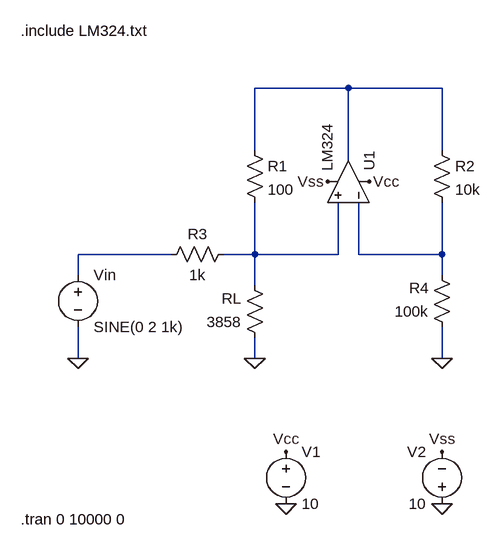
[diagram p0: schematic Circuito_2.asc]
Circuito_2.asc, the LTspice schematic file:
Version 4
SHEET 1 880 680
WIRE 128 0 -16 0
WIRE 272 0 128 0
WIRE -16 96 -16 0
WIRE 272 96 272 0
WIRE 128 112 128 0
WIRE -144 256 -288 256
WIRE -16 256 -16 176
WIRE -16 256 -64 256
WIRE 112 256 112 176
WIRE 112 256 -16 256
WIRE 144 256 144 176
WIRE 272 256 272 176
WIRE 272 256 144 256
WIRE -288 288 -288 256
WIRE 272 288 272 256
WIRE -16 304 -16 256
WIRE -288 416 -288 368
WIRE -16 416 -16 384
WIRE 272 416 272 368
FLAG -16 416 0
FLAG 272 416 0
FLAG 32 640 0
FLAG 272 640 0
FLAG 32 560 Vcc
FLAG 272 560 Vss
FLAG -288 416 0
FLAG 160 144 Vcc
FLAG 96 144 Vss
DATAFLAG 64 304 "-I(Rl)"
DATAFLAG 128 0 ""
DATAFLAG -16 48 "I(R1)"
DATAFLAG -224 240 "I(R3)"
DATAFLAG 368 32 "I(R2)"
DATAFLAG 368 384 "I(R4)"
DATAFLAG 128 0 ""
DATAFLAG 128 0 ""
DATAFLAG 128 0 ""
SYMBOL OpAmps\\opamp2 192 144 M270
SYMATTR InstName U1
SYMATTR Value LM324
SYMBOL res -32 80 R0
SYMATTR InstName R1
SYMATTR Value 100
SYMBOL res 256 80 R0
SYMATTR InstName R2
SYMATTR Value 10k
SYMBOL res -48 240 R90
WINDOW 0 0 56 VBottom 2
WINDOW 3 32 56 VTop 2
SYMATTR InstName R3
SYMATTR Value 1k
SYMBOL res 288 384 R180
WINDOW 0 36 76 Left 2
WINDOW 3 36 40 Left 2
SYMATTR InstName R4
SYMATTR Value 100k
SYMBOL res 0 400 R180
WINDOW 0 36 76 Left 2
WINDOW 3 36 40 Left 2
SYMATTR InstName RL
SYMATTR Value 3858
SYMBOL voltage 32 544 R0
WINDOW 123 0 0 Left 0
WINDOW 39 0 0 Left 0
SYMATTR InstName V1
SYMATTR Value 10
SYMBOL voltage 272 656 R180
WINDOW 0 24 96 Left 2
WINDOW 3 24 16 Left 2
WINDOW 123 0 0 Left 0
WINDOW 39 0 0 Left 0
SYMATTR InstName V2
SYMATTR Value 10
SYMBOL voltage -288 272 R0
WINDOW 123 0 0 Left 0
WINDOW 39 0 0 Left 0
SYMATTR InstName Vin
SYMATTR Value SINE(0 2 1k)
TEXT -376 -88 Left 2 !.include LM324.txt
TEXT -376 664 Left 2 !.tran 0 10000 0

The netlist it stands for:
* Circuito_2.asc
XU1 N003 N004 Vcc Vss N001 LM324  ; pins In+ In- V+ V- OUT
R1 N001 N003 100
R2 N001 N004 10k
R3 N003 N002 1k
R4 0 N004 100k
RL 0 N003 3858
V1 Vcc 0 10
V2 0 Vss 10
Vin N002 0 SINE(0 2 1k)
.include LM324.txt
.tran 0 10000 0
.backanno
.end